# Altium schematic sheet Power.SchDoc: Power and Mechanical
size Letter; DrawnBy: Adam Gilbert; Engineer: J.-F. Cliche; DocumentNumber: 4; Revision: Rev0; SheetNumber: 4; SheetTotal: 5; ProjectTitle: DAN Squid Controller
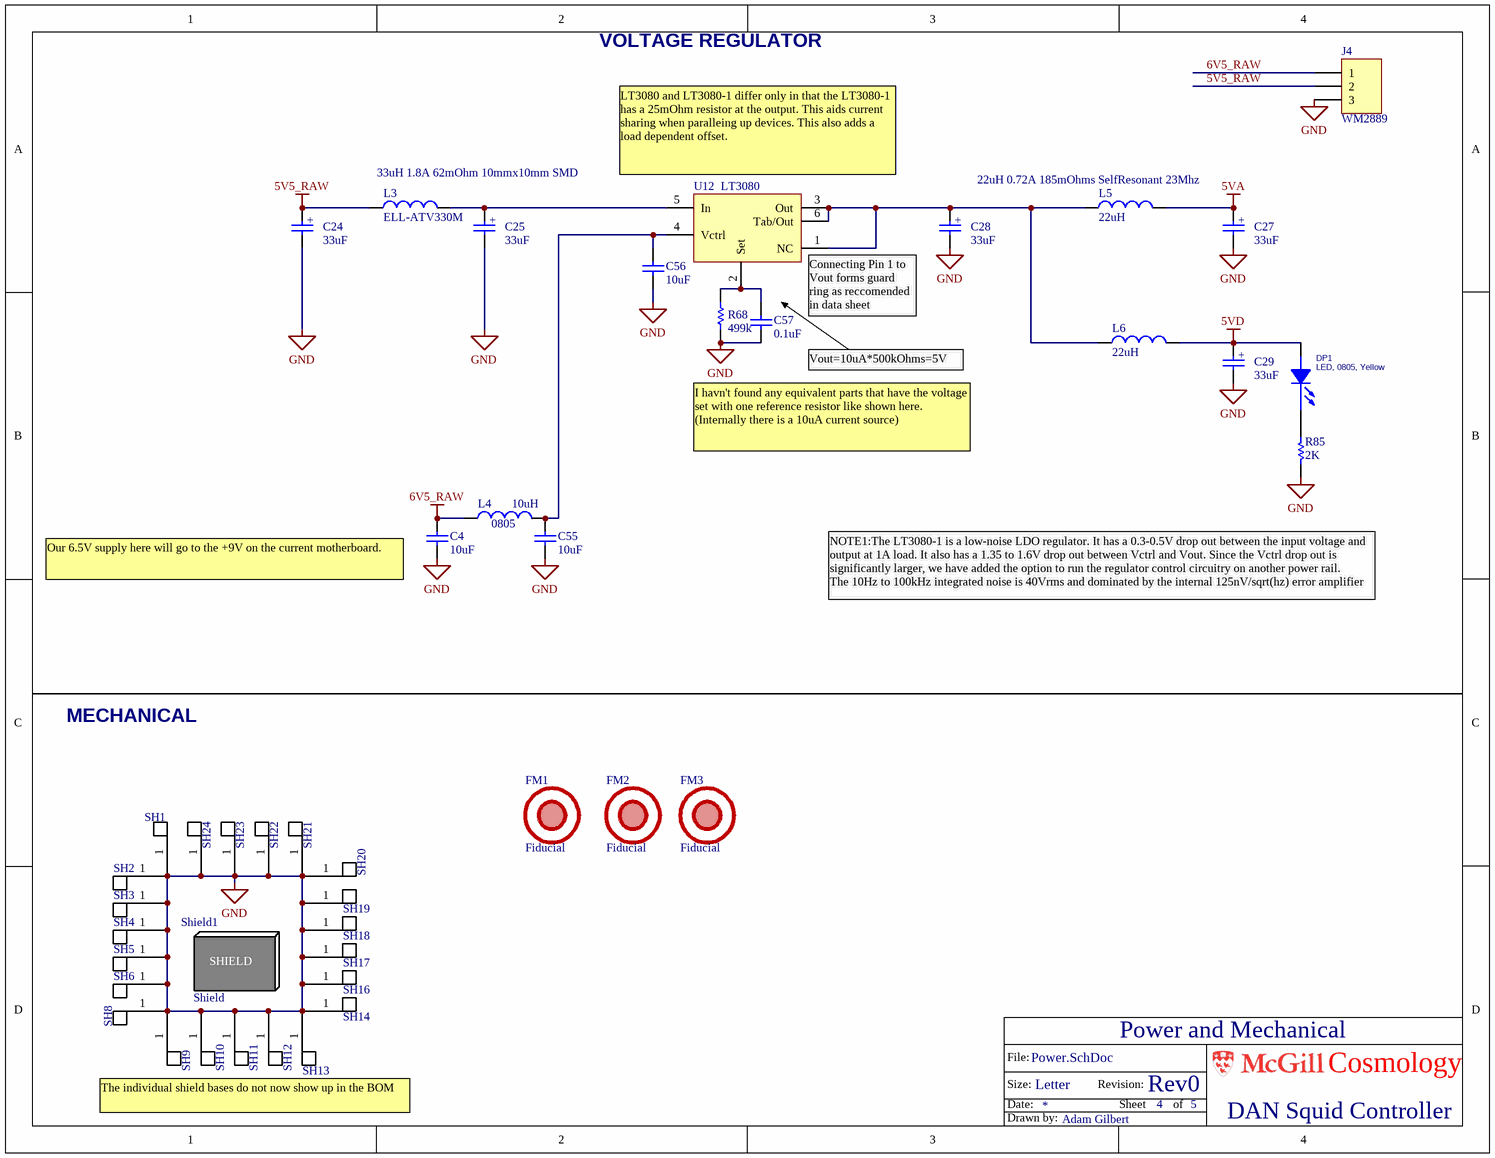
[diagram p0: Power.SchDoc]

## Parts
C4  10uF  [0603]
C24  33uF  [TCASE-D]
C25  33uF  [TCASE-D]
C27  33uF  [TCASE-D]
C28  33uF  [TCASE-D]
C29  33uF  [TCASE-D]
C55  10uF  [0603]
C56  10uF  [0603]
C57  0.1uF  [0603]
DP1  LED, 0805, Yellow  [0805L]
FM1  Fiducial  [Fiducial_mark]  (no BOM)
FM2  Fiducial  [Fiducial_mark]  (no BOM)
FM3  Fiducial  [Fiducial_mark]  (no BOM)
J4  WM2889  [HDR1X3_MolexVertical]
L3  ELL-ATV330M  Description: 33uH 1.8A 62mOhm 10mmx10mm SMD  [ELLATV]
L4  10uH  [0805]
L5  22uH  PartConstraints: 22uH 0.72A 185mOhms SelfResonant 23Mhz  [SRR4028]
L6  22uH  [SRR4028]
R68  499k  [0603]
R85  2k  [0603]
SH1  LeaderTech 20S-CBS-2x0.5x0.2 - DIVIDE QUANITY REQURIED BY 10!  [SHIELD BASE CORNER]  (value not drawn)  (no BOM)
SH2  LeaderTech 20S-CBS-2x0.5x0.2 - DIVIDE QUANITY REQURIED BY 10!  [SHIELD BASE]  (value not drawn)  (no BOM)
SH3  LeaderTech 20S-CBS-2x0.5x0.2 - DIVIDE QUANITY REQURIED BY 10!  [SHIELD BASE]  (value not drawn)  (no BOM)
SH4  LeaderTech 20S-CBS-2x0.5x0.2 - DIVIDE QUANITY REQURIED BY 10!  [SHIELD BASE]  (value not drawn)  (no BOM)
SH5  LeaderTech 20S-CBS-2x0.5x0.2 - DIVIDE QUANITY REQURIED BY 10!  [SHIELD BASE]  (value not drawn)  (no BOM)
SH6  LeaderTech 20S-CBS-2x0.5x0.2 - DIVIDE QUANITY REQURIED BY 10!  [SHIELD BASE]  (value not drawn)  (no BOM)
SH8  LeaderTech 20S-CBS-2x0.5x0.2 - DIVIDE QUANITY REQURIED BY 10!  [SHIELD BASE CORNER]  (value not drawn)  (no BOM)
SH9  LeaderTech 20S-CBS-2x0.5x0.2 - DIVIDE QUANITY REQURIED BY 10!  [SHIELD BASE]  (value not drawn)  (no BOM)
SH10  LeaderTech 20S-CBS-2x0.5x0.2 - DIVIDE QUANITY REQURIED BY 10!  [SHIELD BASE]  (value not drawn)  (no BOM)
SH11  LeaderTech 20S-CBS-2x0.5x0.2 - DIVIDE QUANITY REQURIED BY 10!  [SHIELD BASE]  (value not drawn)  (no BOM)
SH12  LeaderTech 20S-CBS-2x0.5x0.2 - DIVIDE QUANITY REQURIED BY 10!  [SHIELD BASE]  (value not drawn)  (no BOM)
SH13  LeaderTech 20S-CBS-2x0.5x0.2 - DIVIDE QUANITY REQURIED BY 10!  [SHIELD BASE CORNER]  (value not drawn)  (no BOM)
SH14  LeaderTech 20S-CBS-2x0.5x0.2 - DIVIDE QUANITY REQURIED BY 10!  [SHIELD BASE]  (value not drawn)  (no BOM)
SH16  LeaderTech 20S-CBS-2x0.5x0.2 - DIVIDE QUANITY REQURIED BY 10!  [SHIELD BASE]  (value not drawn)  (no BOM)
SH17  LeaderTech 20S-CBS-2x0.5x0.2 - DIVIDE QUANITY REQURIED BY 10!  [SHIELD BASE]  (value not drawn)  (no BOM)
SH18  LeaderTech 20S-CBS-2x0.5x0.2 - DIVIDE QUANITY REQURIED BY 10!  [SHIELD BASE]  (value not drawn)  (no BOM)
SH19  LeaderTech 20S-CBS-2x0.5x0.2 - DIVIDE QUANITY REQURIED BY 10!  [SHIELD BASE]  (value not drawn)  (no BOM)
SH20  LeaderTech 20S-CBS-2x0.5x0.2 - DIVIDE QUANITY REQURIED BY 10!  [SHIELD BASE CORNER]  (value not drawn)  (no BOM)
SH21  LeaderTech 20S-CBS-2x0.5x0.2 - DIVIDE QUANITY REQURIED BY 10!  [SHIELD BASE]  (value not drawn)  (no BOM)
SH22  LeaderTech 20S-CBS-2x0.5x0.2 - DIVIDE QUANITY REQURIED BY 10!  [SHIELD BASE]  (value not drawn)  (no BOM)
SH23  LeaderTech 20S-CBS-2x0.5x0.2 - DIVIDE QUANITY REQURIED BY 10!  [SHIELD BASE]  (value not drawn)  (no BOM)
SH24  LeaderTech 20S-CBS-2x0.5x0.2 - DIVIDE QUANITY REQURIED BY 10!  [SHIELD BASE]  (value not drawn)  (no BOM)
Shield1  Shield
U12  LT3080  [D2-PAK-6_LT3080]

## Nets
5V5_RAW: C24.1 J4.2 L3.1
5VA: C27.1 L5.2
5VD: C29.1 DP1.1(ANODE) L6.2
6V5_RAW: C4.2 J4.1 L4.2
GND: C4.1 C24.2 C25.2 C27.2 C28.2 C29.2 C55.1 C56.1 C57.1 J4.3 R68.1 R85.2 SH1.1 SH2.1 SH3.1 SH4.1 SH5.1 SH6.1 SH8.1 SH9.1 SH10.1 SH11.1 SH12.1 SH13.1 SH14.1 SH16.1 SH17.1 SH18.1 SH19.1 SH20.1 SH21.1 SH22.1 SH23.1 SH24.1
NetC25_1: C25.1 L3.2 U12.5(In)
NetC28_1: C28.1 L5.1 L6.1 U12.1(NC) U12.3(Out) U12.6(Tab/Out)
NetC55_2: C55.2 C56.2 L4.1 U12.4(Vctrl)
NetC57_2: C57.2 R68.2 U12.2(Set)
NetDP1_2: DP1.2(CATHODE) R85.1

## Notes on the sheet
- VOLTAGE REGULATOR
- (near U12) LT3080 and LT3080-1 differ only in that the LT3080-1 has a 25mOhm resistor at the output. This aids current sharing when paralleing up devices. This also adds a load dependent offset.
- (near C57) Vout=10uA*500kOhms=5V
- (near U12) Connecting Pin 1 to Vout forms guard ring as reccomended in data sheet
- I havn't found any equivalent parts that have the voltage set with one reference resistor like shown here. (Internally there is a 10uA current source)
- (near C4) Our 6.5V supply here will go to the +9V on the current motherboard.
- NOTE1:The LT3080-1 is a low-noise LDO regulator. It has a 0.3-0.5V drop out between the input voltage and output at 1A load. It also has a 1.35 to 1.6V drop out between Vctrl and Vout. Since the Vctrl drop out is significantly larger, we have added the option to run the regulator control circuitry on another power rail.
  The 10Hz to 100kHz integrated noise is 40Vrms and dominated by the internal 125nV/sqrt(hz) error amplifier
- MECHANICAL
- The individual shield bases do not now show up in the BOM
- File:
- Size:
- Date:
- Letter
- Revision:
- Sheet
- of
- Cosmology
- Drawn by:
- (in symbol SHIELD 20S-CBS-3x2.5x0.2) SHIELD
- (in symbol Tantalum) +

## Library data of the parts
C4 C55 C56 = Cap0603: Capacitor, Ceramic, 0603; Manufacturer: Generic; Part Constraints: CAP CER 10UF 10V 20% X5R 0603; Supplier 1: Digi-Key; Supplier Part Number 1: 587-2562-1-ND; Value: 10uF
C24 C25 C27-C29 = Tantalum: CAP TANT CASE-D; Manufacturer: Generic; Part Constraints: CAP TANT 33UF 16V 20% 2917; Voltage: 16V; ESR: 100mOhms; Footprint: D; Value: 33uF; Supplier 1: Digi-Key
  C24: Supplier Part Number 1: 399-4738-2-ND; Supplier 2: Digi-Key; Supplier Part Number 2: 399-4738-1-ND
  C25 C27-C29: Supplier Part Number 1: 399-4738-1-ND
C57 = Cap0603: Capacitor, Ceramic, 0603; Part Constraints: 0.1uF 16V 10% X7R; Manufacturer: Generic; Supplier 1: Digi-Key; Supplier Part Number 1: 399-1096-1-ND; Value: 0.1uF
DP1 = LED, yellow, 0805, 2mA: LED; Part Constraints: 511-1293-1-ND; Supplier 1: Digi-Key; Supplier Part Number 1: 511-1293-1-ND
J4 = Header 3: 3-Pin 0.1" header; Manufacturer: Digikey; Part Constraints: WM2889; Supplier 1: Molex; Supplier Part Number 1: WM2889-ND
L3 = ELL-ATV330M: 33uH 1.8A inductor 10mmx10mm; Manufacturer: Panasonic - ECG; Inductance: 33µH; Type: Ferrite Core; Tolerance: ±20%; Shielding: Shielded; DC Resistance (DCR): 62 mOhm; Frequency - Test: 100kHz; RoHS: RoHS Compliant; Category: Inductors, Coils, Chokes; Stock 1: 6281; Pricing 1: 1=2.28, 10=2.15, 50=2.0154, 100=1.8811 (CAD); Current: 1.8A; Current - Saturation: -; Current - Temperature Rise: -; Q @ Freq: -; Frequency - Self Resonant: -; Applications: General Purpose; Material - Core: -; Package / Case: 0.394" L x 0.394" W x 0.177" H (10.00mm x 10.00mm x 4.50mm); Mounting Type: Surface Mount; Packaging: Cut Tape (CT); Operating Temperature: -; ComponentLink1URL: http://industrial.panasonic.com/www-cgi/jvcr13pz.cgi?E+PZ+2+AGM0010+0+4+WW; ComponentLink1Description: http://industrial.panasonic.com/www-cgi/jvcr13pz.cgi?E+PZ+2+AGM0010+0+4+WW; Supplier 1: Digi-Key; Supplier Part Number 1: PCD1754CT-ND; Part Constraints: ELL-ATV330M
L4 = Inductor0603: Inductor 0805; PartConstraints: INDUCTOR 10UH 100MA 20% 0805; Manufacturer: TDK Corporation; Part Constraints: GLFR2012T100M-LR; Resistance: <300mOhm; CurrentRating: 100mA; Inductance: 10uH; Supplier 1: Digi-Key; Supplier Part Number 1: 445-3614-1-ND
L5 = InductorSRR4028: =PartConstraints; Manufacturer: Bourns; Part Constraints: SRR4028-220YCT-ND; Resistance: 185mOhms; CurrentRating: 0.72A; SRF: SelfResonant 23Mhz; Inductance: 22uH; Supplier 1: Digi-Key; Supplier Part Number 1: SRR4028-220YCT-ND
L6 = InductorSRR4028: =PartConstraints; Manufacturer: Bourns; PartConstraints: 22uH 0.72A 185mOhms SelfResonant 23Mhz; Part Constraints: SRR4028-220YCT-ND; Resistance: 185mOhms; CurrentRating: 0.72A; SRF: SelfResonant 23Mhz; Inductance: 22uH; Supplier 1: Digi-Key; Supplier Part Number 1: SRR4028-220YCT-ND
R68 = RES 0603: Manufacturer: Generic; Manufacturer Part Number 1: e.g CRCW0603 series; Part constraints: 499k 1/10W 1% 100ppm/C 0603; Value: 499k; Supplier 1: Digi-Key; Supplier Part Number 1: 541-499KHCT-ND
R85 = Res0603: RES 0603; Manufacturer: Generic; Part constraints: RES 2.00K OHM 1/10W 1% 0603 SMD; Manufacturer Part Number 1: e.g CRCW0603 series; Value: 2K; Supplier 1: Digi-Key; Supplier Part Number 1: 541-2.00KHCT-ND
SH1-SH6 SH8-SH14 SH16-SH24 = ShieldBase: Part Constraints: 20S-CBS-3x2.5x0.2  (divide quantity by 22); Manufacturer: LeaderTech; Supplier 1: LeaderTech; Supplier Part Number 1: 20S-CBS-3x2.5x0.2  (divide quantity by 22)
Shield1 = SHIELD 20S-CBS-3x2.5x0.2: 20S-CBSA-3x2.5x0.2 (assembled fence and cover); Manufacturer: Leadertech; Supplier 1: Leadertech; Supplier Part Number 1: 20S-CBSA-3x2.5x0.2 (assembled fence and cover); Part Constraints: 20S-CBSA-3x2.5x0.2 (assembled fence and cover)
U12 = LT3080: Low dropout regulator, single resistor, 1.1A; Manufacturer: Linear Technology; Supplier 1: Digi-Key; Supplier Part Number 1: LT3080EQ#PBF-ND; Part Constraints: D2-PAK-6_LT3080